# Altium schematic sheet Accelerometer.SchDoc
size A
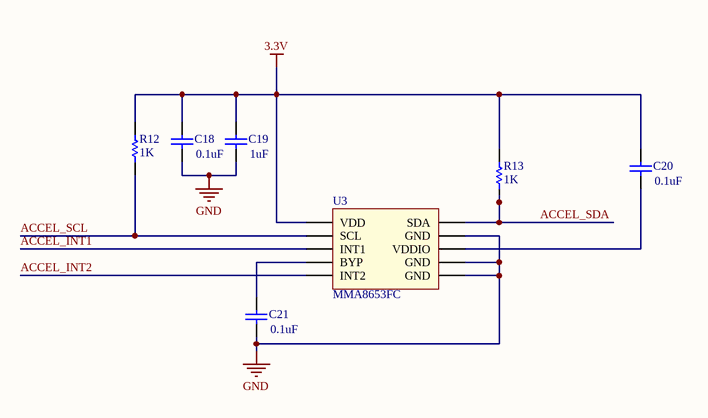
[diagram p0: Accelerometer.SchDoc]

## Parts
C18  value 0.1uF  [0805]  (hidden comment: Cap)
C19  value 1uF  [0805]  (hidden comment: Cap)
C20  value 0.1uF  [0805]  (hidden comment: Cap)
C21  value 0.1uF  [0805]  (hidden comment: Cap)
R12  value 1K  [0805]  (hidden comment: Resistor)
R13  value 1K  [0805]  (hidden comment: Resistor)
U3  MMA8653FC  [DFN-10]

## Nets
3.3V: C18.2 C19.2 C20.2 R12.2 R13.2 U3.1(VDD)
GND: C18.1 C19.1 C21.1 U3.6(GND) U3.7(GND) U3.9(GND)
ACCEL_INT1: U3.3(INT1)
ACCEL_INT2: U3.5(INT2)
ACCEL_SCL: R12.1 U3.2(SCL)
ACCEL_SDA: R13.1 U3.10(SDA)
NetC20_1: C20.1 U3.8(VDDIO)
NetC21_2: C21.2 U3.4(BYP)

## Library data of the parts
C18-C21 = Cap: Capacitor
U3 = MMA8653FC: MMA8653FC Accelerometer 3-Axis
R12 R13 = Resistor: Published: 8-Jun-2000; LatestRevisionDate: 17-Jul-2002; LatestRevisionNote: Re-released for DXP Platform.; PackageReference: AXIAL-0.3; Publisher: Altium Limited